# EAGLE design Controller_v.2 (EAGLE 6.4)
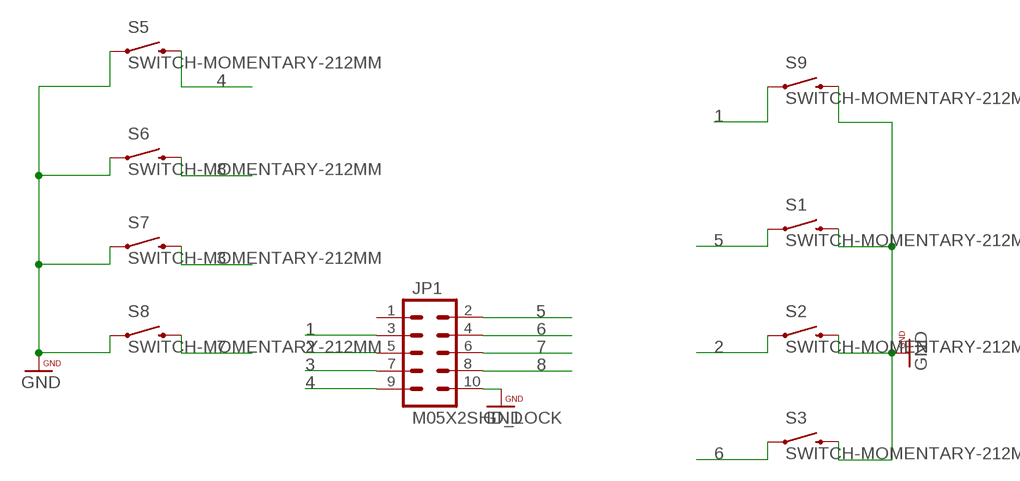
[diagram p0: schematic, sheet 1]

## Parts
JP1  M05X2SHD_LOCK  [2X5-SHROUDED_LOCK]
S1  SWITCH-MOMENTARY-212MM  [TACTILE-PTH-12MM]
S2  SWITCH-MOMENTARY-212MM  [TACTILE-PTH-12MM]
S3  SWITCH-MOMENTARY-212MM  [TACTILE-PTH-12MM]
S5  SWITCH-MOMENTARY-212MM  [TACTILE-PTH-12MM]
S6  SWITCH-MOMENTARY-212MM  [TACTILE-PTH-12MM]
S7  SWITCH-MOMENTARY-212MM  [TACTILE-PTH-12MM]
S8  SWITCH-MOMENTARY-212MM  [TACTILE-PTH-12MM]
S9  SWITCH-MOMENTARY-212MM  [TACTILE-PTH-12MM]

## Nets
1: JP1.3 S9.1
2: JP1.5 S2.1
3: JP1.7 S7.3
4: JP1.9 S5.3
5: JP1.2 S1.1
6: JP1.4 S3.1
7: JP1.6 S8.3
8: JP1.8 S6.3
GND: JP1.10 S1.3 S2.3 S3.3 S5.1 S6.1 S7.1 S8.1 S9.3
Unconnected: JP1.1

## Library data of the parts
JP1 = SparkFun-Connectors:M05X2: Header 5x2 Standard 10-pin dual row 0.1" header. Commonly used with AVR-ISP. Use with Spark Fun Electronics SKU: PRT-00778
S1-S3 S5-S9 = SparkFun-Electromechanical:SWITCH-MOMENTARY-2: Various NO switches- pushbuttons, reed, etc; PROD_ID: SWCH-09185

## Board
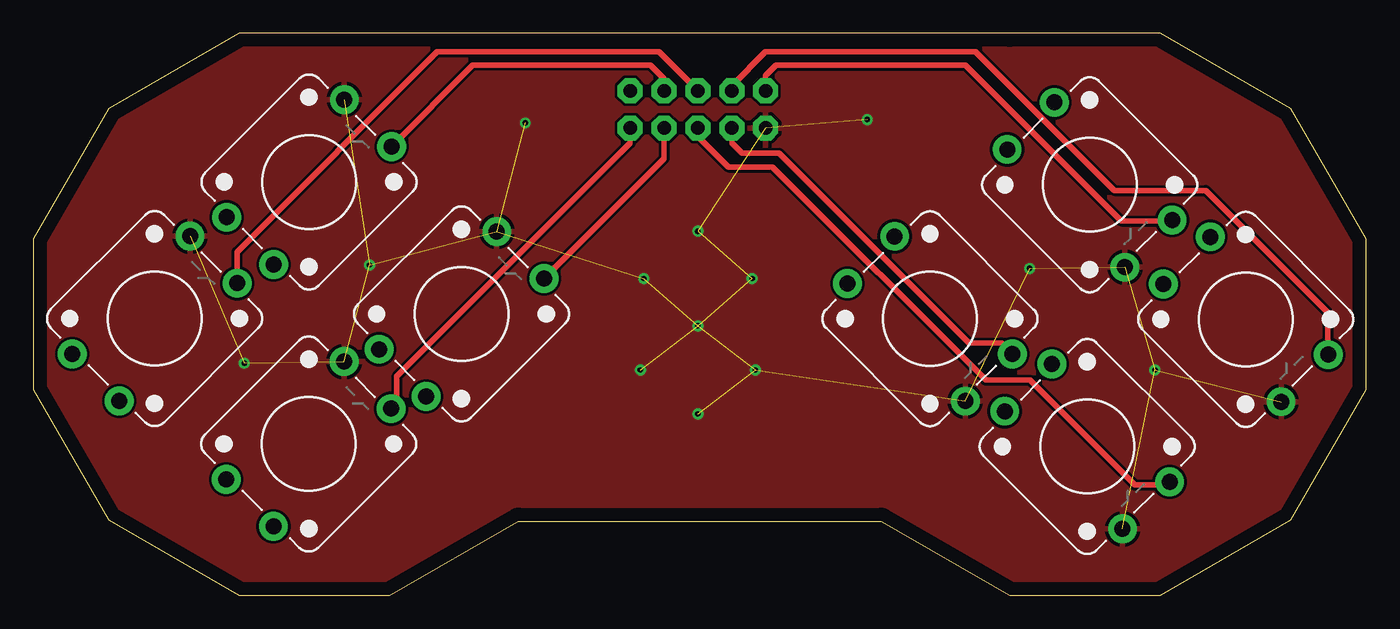
[diagram p1: board, top side]
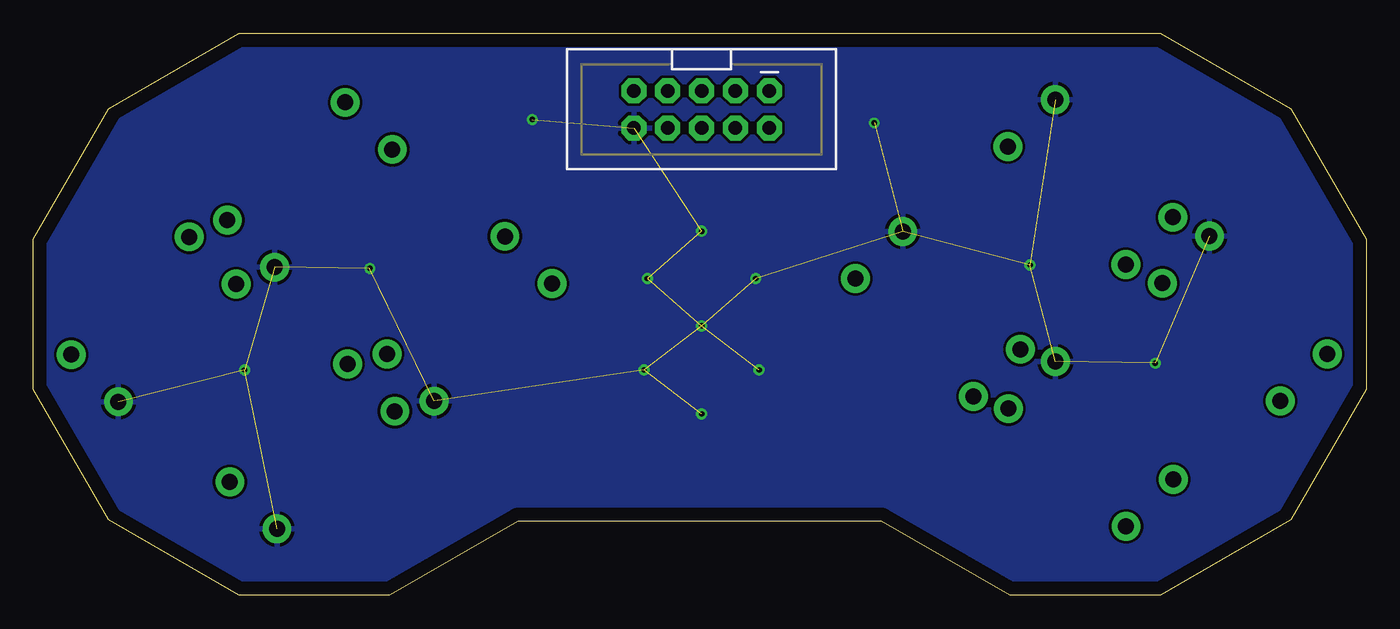
[diagram p2: board, bottom side, seen from below]

Size 100 x 42.18 mm. Coordinates in mm from the lower left corner, seen from the top.
Outline: 94.35,36.53 84.56,42.18 73.26,42.18 73.26,42.18 15.44,42.18 5.65,36.53 0,26.74 0,15.44 5.65,5.65 15.44,0 26.74,0 36.38,5.57 63.62,5.57 73.26,0 84.56,0 94.35,5.65 100,15.44 100,26.74 94.35,36.53
Copper layers (1*16): Top 0.035mm / dielectric 1.5mm / Bottom 0.035mm
Design rules "default *": minimum track width 10mil, minimum drill 10mil, track to track 8mil, track to pad 8mil, pad to pad 8mil, via to via 8mil, smd to smd 8mil, copper to edge 40mil, drill to drill 3mil, minimum pad ring 10mil, minimum via ring 8mil, stop-mask expansion 4mil, vias tented up to drill 16mil, thermal gap 10mil

### Footprints (pad centres in the part's own frame; a part is rotated, then mirrored left to right if it is on the bottom)
2X5-SHROUDED_LOCK = drill 1.016 pad 1.88 octagon: 1 -1.397,5.08; 2 1.397,5.08; 3 -1.397,2.54; 4 1.397,2.54; 5 -1.397,0; 6 1.397,0; 7 -1.397,-2.54; 8 1.397,-2.54; 9 -1.397,-5.08; 10 1.397,-5.08
TACTILE-PTH-12MM = drill 1.2 pad 2.159: 1 6.25,-2.5; 2 -6.25,-2.5; 3 6.25,2.5; 4 -6.25,2.5

### Placement (x,y rotation side)
JP1  49.86,36.47 270 bottom
S1  20.67,11.36 45 top
S2  9.1,20.77 45 top
S3  32.12,21.11 45 top
S5  79.25,30.81 315 top
S6  67.27,20.75 315 top
S7  90.96,20.71 315 top
S8  79.07,11.16 315 top
S9  20.68,31.02 45 top

### Tracks (layer width: path | path; a pad name or v marks a point on that pad's centre or on a via)
1
  Top 0.406: JP1.3 47.32,38.76 46.31,39.77 32.97,39.77 S9.1
2
  Top 0.406: S2.1 15.29,25.77 30.3,40.79 46.94,40.79 JP1.5
3
  Top 0.406: JP1.7 52.4,38.25 54.94,40.79 70.69,40.79 81.1,30.38 87.96,30.38 97.11,21.23 97.11,18.1 S7.3
4
  Top 0.406: JP1.9 54.94,39.01 55.7,39.77 69.93,39.77 81.61,28.09 85.37,28.09 S5.3
5
  Top 0.406: JP1.2 44.78,33.93 27.26,16.41 27.26,14.41 S1.1
6
  Top 0.406: JP1.4 47.32,32.78 S3.1
7
  Top 0.406: JP1.6 49.86,34.44 52.15,32.15 55.45,32.15 71.45,16.15 74.75,16.15 82.63,8.28 85.02,8.28 S8.3
8
  Top 0.406: JP1.8 52.4,33.93 53.16,33.17 55.96,33.17 70.18,18.95 72.61,18.95 S6.3
GND  (via drill 0.41)  (21 unrouted)
  other vias: 49.86,20.22 49.86,27.33 49.86,13.61 54.18,16.91 45.54,16.91 45.8,23.77 62.56,35.71 36.91,35.46 74.75,24.53 84.15,16.91 15.83,17.42 25.22,24.79 53.93,23.77
  pour Top: 0.84,49.68 112.09,49.68 112.09,-6.45 -3.99,-6.45 -3.99,49.68
  pour Bottom: -0.18,50.19 111.08,50.19 111.08,-5.95 -5,-5.95 -5,50.19